# EasyEDA Pro project 内机V10_1.epro, board PCB11_1
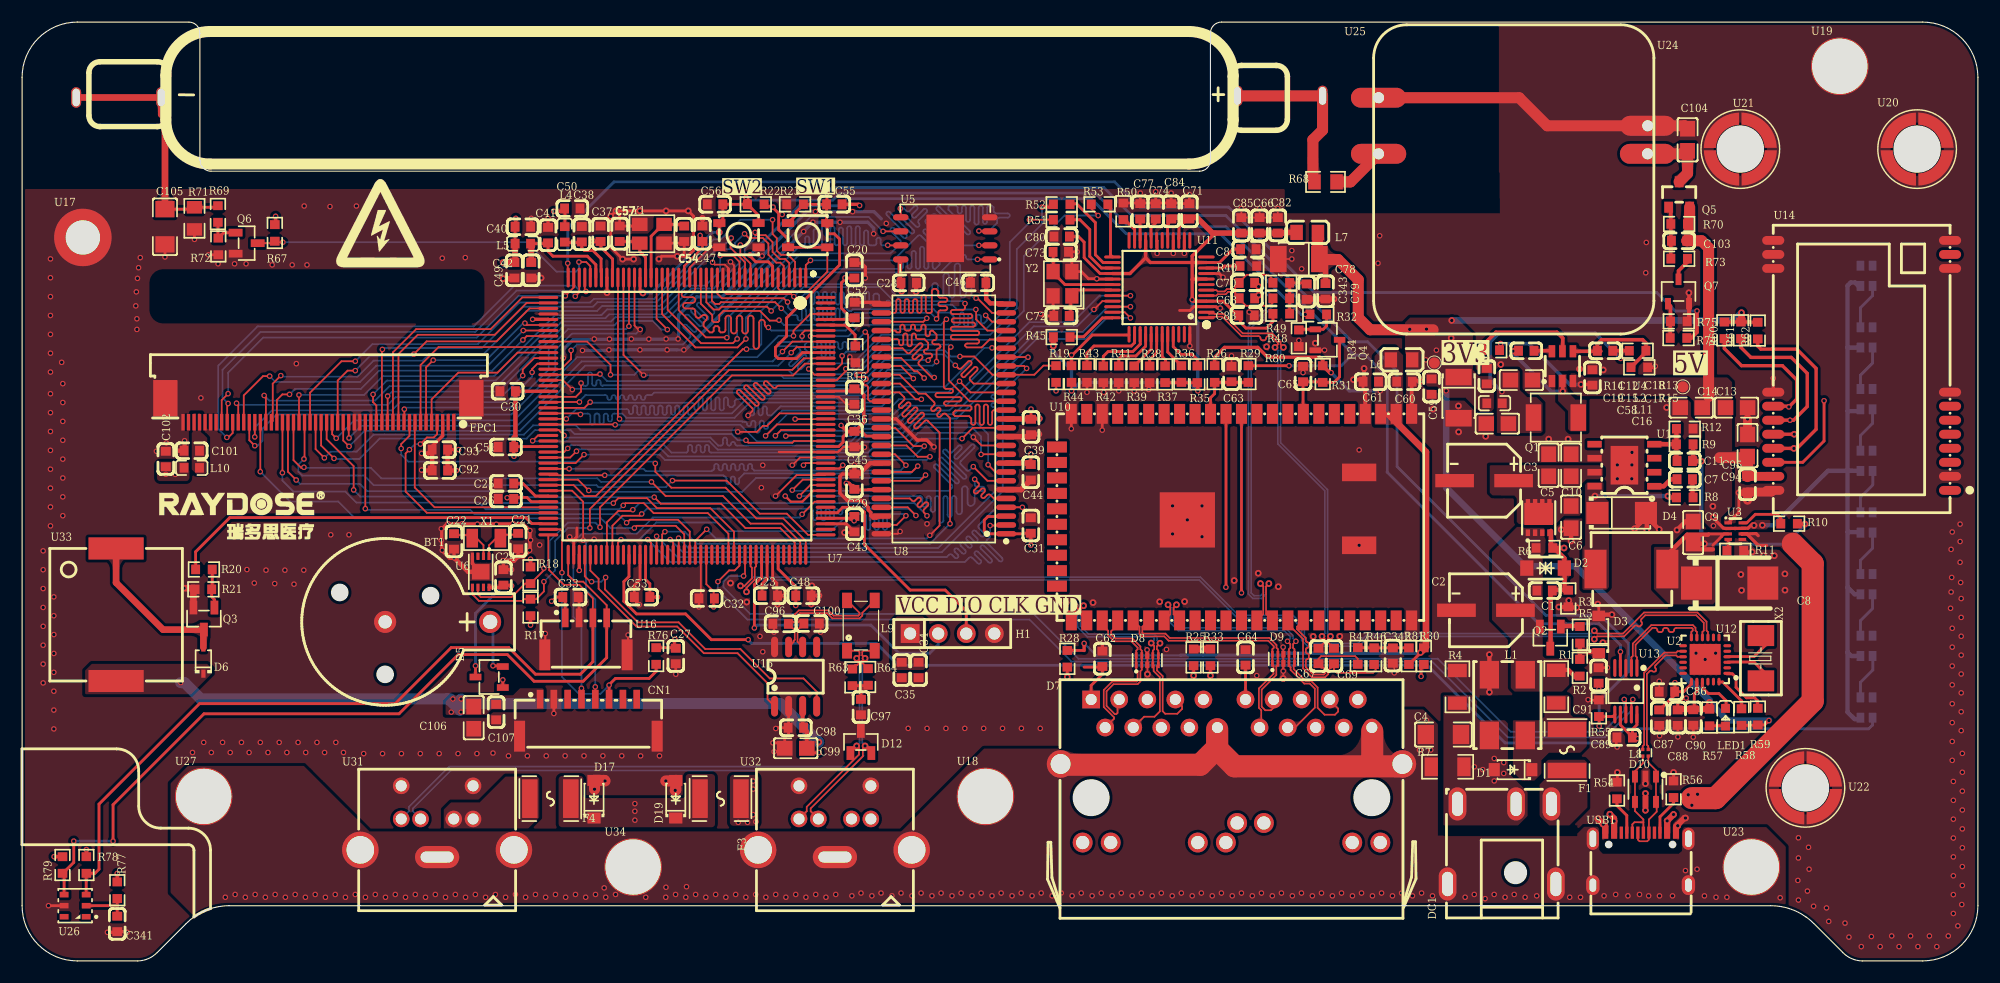
[diagram p6: board, top side]
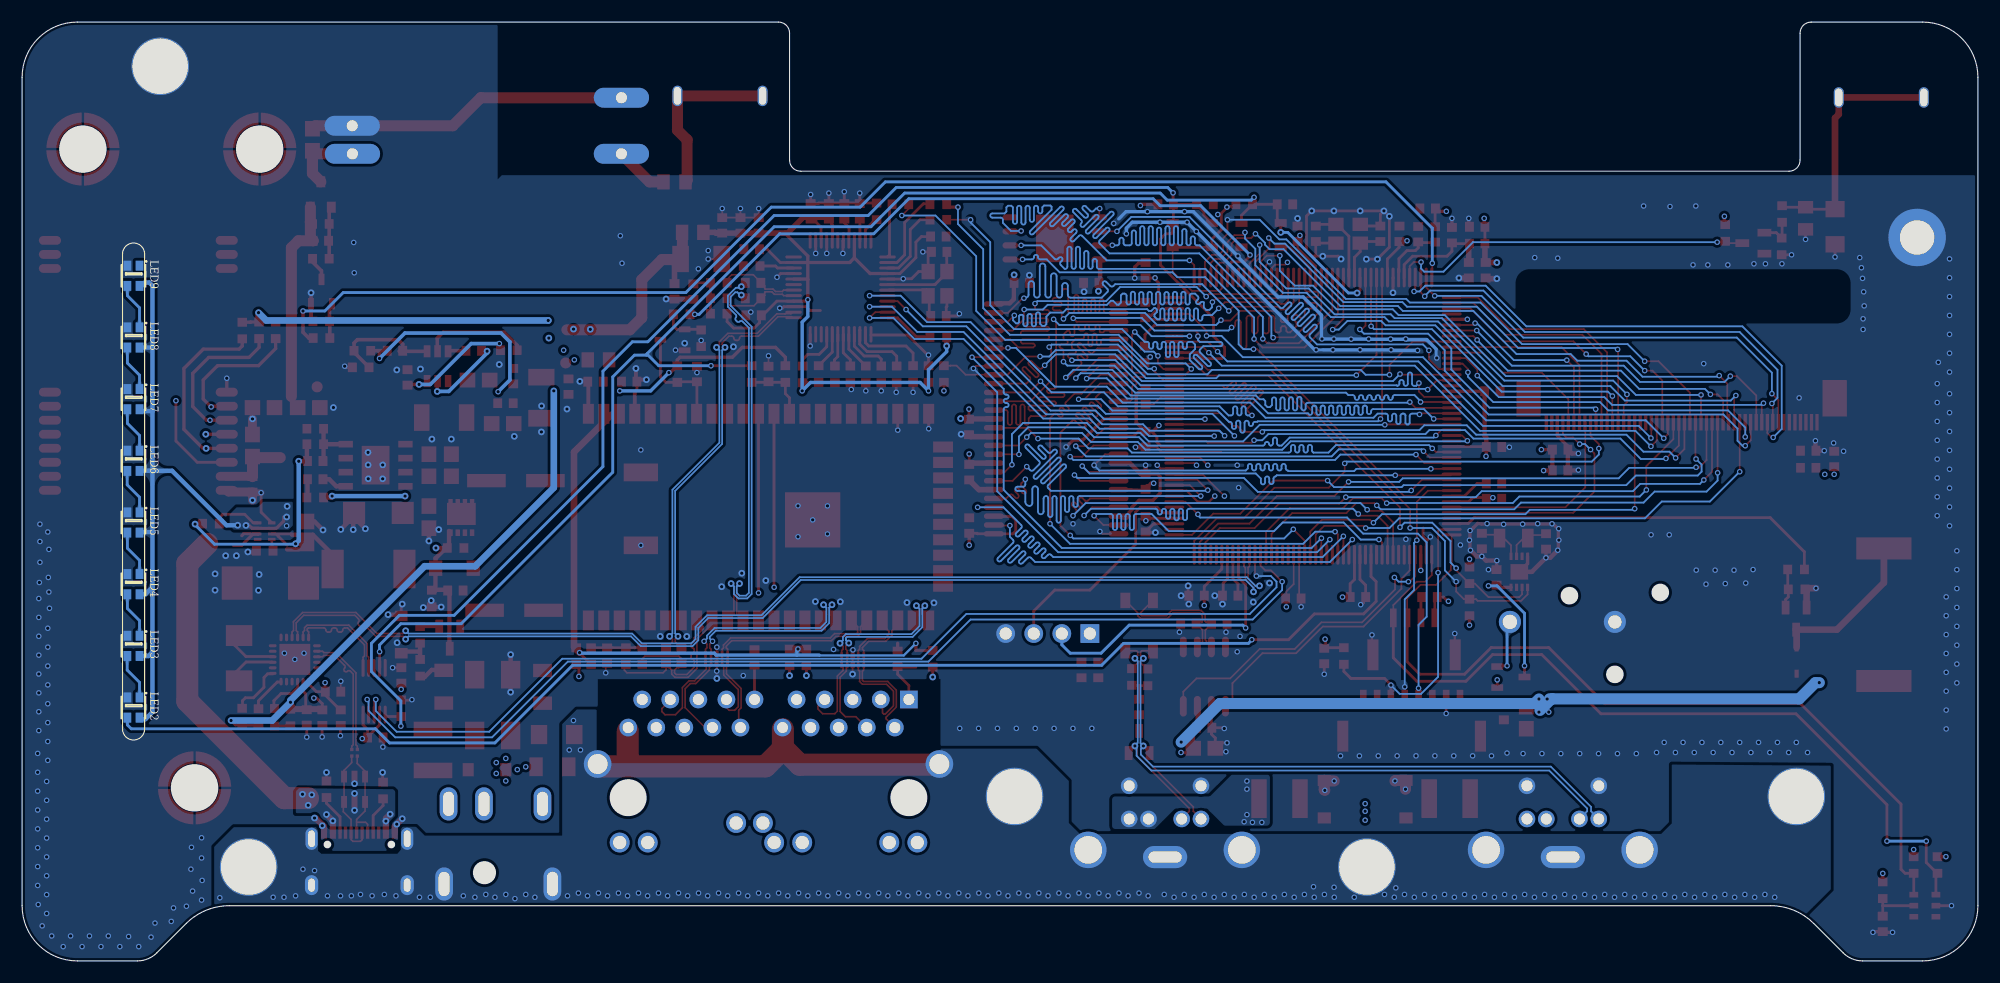
[diagram p7: board, bottom side, seen from below]

Outline 177 x 85 mm; copper layers: Top Layer, Inner1, Inner2, Bottom Layer. Coordinates in mm from the lower left corner of the outline.
Outline path: 0,80 arc(1.46,83.54) 5,85 15.09,85 arc(15.8,84.71) 16.09,84 16.09,72.5 arc(16.39,71.79) 17.09,71.5 106.54,71.5 arc(107.25,71.79) 107.54,72.5 107.54,84 arc(107.84,84.71) 108.54,85 172,85 arc(175.54,83.54) 177,80 177,5 arc(175.54,1.46) 172,0 166.57,0 arc(165.61,0.19) 164.8,0.73 162.15,3.39 arc(161.81,3.71) 161.44,3.99 arc(160.72,4.42) 159.94,4.74 arc(159.11,4.93) 158.26,5 18.74,5 arc(16.64,4.58) 14.85,3.39 12.2,0.73 arc(11.39,0.19) 10.43,0 5,0 arc(1.46,1.46) 0,5 0,80
Stack: Top Layer 0.035mm 外层铜厚1oz / Dielectric1 0.0994mm 3313 RC57% 4.2mil / Inner1 0.0152mm 内层铜厚 / Dielectric2 1.265mm 1.3mm H/HOZ Copper / Inner2 0.0152mm 内层铜厚 / Dielectric3 0.0994mm 3313 RC57% 4.2mil / Bottom Layer 0.035mm 外层铜厚1oz

## Design rules (mm)
net $5N526: DP6
net $5N525: DP6
net WLAN_RXN: DP12
net MDI_TD-: DP11
net WLAN_RXP: DP12
net MDI_TD+: DP11
net MDI_RD-: DP14
net WLAN_TXN: DP13
net MDI_RD+: DP14
net WLAN_TXP: DP13
net RD-: DP8
net RD+: DP8
net TD-: DP7
net TD+: DP7
net TPRX-: DP10
net TPRX+: DP10
net TPTX-: DP9
net TPTX+: DP9
net CANH: DP5
net CANL: DP5
net DN: DP1
net DP: DP1
net USB_D+: DP2
net USB_D-: DP2
net STM32_D+: DP3
net STM32_D-: DP3
net STM32_OTG_D-: DP4
net STM32_OTG_D+: DP4
template: 自定义配置
spacing copperThickness1oz (default): track to track 0.102, other pairs 0.152 to 0.3
spacing copperThickness2oz: track to track 0.203, other pairs 0.152 to 0.3
track width copperThickness1oz (default): min 0.127, default 0.254, max 2.54
track width copperThickness2oz: min 0.203, default 0.254, max 2.54
differential pair differentialPair (default): width min 0.127, default 0.148, max 0.254; gap min 0.102, default 0.102
via viaSize (default): diameter min 0.5, default 0.5, max 10; hole min 0.3, default 0.305, max 6.3
net GND uses copperRegion1
net $2N1394 uses copperRegion1
net VCC_24V uses copperRegion1
net VCC_5V uses copperRegion1
net VCC_3V3 uses copperRegion2
net PHY_3V3 uses copperRegion1
net PGND uses copperRegion1
net $2N7879 uses copperRegion1
net $2N7887 uses copperRegion1
net SYS_5V uses copperRegion1
net LCD_VCC uses copperRegion2
net 24V uses copperRegion1
net LGND uses copperRegion1
net VBUS uses copperRegion1
net $2N4615 uses copperRegion1
net $5N32411 uses copperRegion1
net $5N49929 uses copperRegion1
net $2N31144 uses copperRegion2
pour e416 uses copperRegion1

## Placement (name value [footprint] x y rotation side)
BT1  BS-12-A6AJ019  [BAT-TH_BS-12-A6AJ019]  32.86 30.69 270 top
C1  100nF  [C0603]  137.79 33.53 180 top
C2  100uF  [CAP-SMD_BD6.3-L6.5-W6.5-LS7.2-FD]  132.48 31.75 180 top
C3  100uF  [CAP-SMD_BD6.3-L6.5-W6.5-LS7.2-FD]  132.31 43.48 180 top
C4  1nF/2KV  [C1206]  128.63 20.5 180 top
C5  100nF  [C0805]  138.15 44.88 270 top
C6  100nF  [C0805]  140.18 40.18 90 top
C7  10nF  [C0603]  150.47 43.61 0 top
C8  220uF  [CASE-D_7343]  154.53 34.21 180 top
C9  100nF  [C0805]  151.23 38.78 270 top
C10  100nF  [C0805]  140.18 44.88 270 top
C11  470pF  [C0603]  150.47 45.26 0 top
C12  100nF  [C0603]  136.13 55.24 180 top
C13  22uF  [C0805]  155.16 50.09 180 top
C14  22uF  [C0805]  151.06 50.09 0 top
C15  22uF  [C0805]  135.69 52.59 180 top
C16  22uF  [C0805]  133.51 48.64 0 top
C17  100nF  [C0603]  142.12 52.83 270 top
C18  75pF  [C0603]  143.26 55.24 0 top
C19  100nF  [C0603]  132.56 52.94 270 top
C20  100nF  [C0603]  75.32 62.53 90 top
C21  12pF  [C0603]  44.89 38.02 90 top
C22  12pF  [C0603]  39.08 37.98 90 top
C23  2.2uF  [C0603]  67.67 33.07 0 top
C24  10nF  [C0603]  43.56 34.73 270 top
C25  2.2uF  [C0603]  43.79 43.23 0 top
C26  100nF  [C0603]  43.79 41.83 180 top
C27  100nF  [C0603]  59.16 27.61 270 top
C28  100nF  [C0603]  80.24 61.39 0 top
C29  100nF  [C0603]  75.32 43.39 90 top
C30  100nF  [C0603]  43.94 51.58 180 top
C31  100nF  [C0603]  91.29 39.42 90 top
C32  100nF  [C0603]  61.95 32.81 180 top
C33  100nF  [C0603]  49.63 32.94 0 top
C34  100nF  [C0603]  81.13 26.34 270 top
C35  10uF  [C0603]  79.6 26.34 90 top
C36  10uF  [C0603]  75.32 51.09 90 top
C37  100nF  [C0603]  52.35 65.83 90 top
C38  100nF  [C0603]  50.65 65.79 90 top
C39  10uF  [C0603]  91.31 48.34 90 top
C40  100nF  [C0603]  45.31 66.47 0 top
C41  100nF  [C0603]  47.6 65.71 90 top
C42  10uF  [C0603]  46.08 62.53 90 top
C43  100nF  [C0603]  75.32 39.55 90 top
C44  100nF  [C0603]  91.29 44.24 90 top
C45  100nF  [C0603]  75.32 47.24 90 top
C46  100nF  [C0603]  86.53 61.39 0 top
C47  100nF  [C0603]  61.57 65.83 270 top
C48  100nF  [C0603]  70.71 33.07 180 top
C49  100nF  [C0603]  44.55 62.53 90 top
C50  100nF  [C0603]  49.79 68.12 180 top
C51  100nF  [C0603]  43.79 46.53 0 top
C52  10uF  [C0603]  75.35 58.93 90 top
C53  10uF  [C0603]  56.11 32.94 180 top
C54  20pf  [C0603]  59.92 65.83 90 top
C55  100nF  [C0603]  73.51 68.5 180 top
C56  100nF  [C0603]  62.71 68.5 0 top
C57  20pf  [C0603]  54.08 65.83 270 top
C58  100uF  [CASE-B_3528]  130.01 50.99 270 top
C59  100nF  [C0603]  127.56 51.99 90 top
C60  100nF  [C0603]  125.11 52.44 180 top
C61  100nF  [C0603]  122.06 52.44 0 top
C62  100nF  [C0603]  97.77 27.35 90 top
C63  100nF  [C0603]  109.45 53.13 270 top
C64  100nF  [C0603]  110.72 27.48 90 top
C65  100nF  [C0603]  115.93 53.13 270 top
C66  100nF  [C0603]  111.99 66.6 90 top
C67  6.8nF  [C0603]  117.32 27.61 270 top
C68  6.8nF  [C0603]  110.85 59.99 180 top
C69  6.8nF  [C0603]  118.72 27.61 270 top
C70  6.8nF  [C0603]  110.85 61.39 180 top
C71  100nF  [C0603]  105.64 67.87 90 top
C72  12pF  [C0603_1]  94.07 58.39 0 top
C73  12pF  [C0603_1]  94 64.19 180 top
C74  4.7uF  [C0603]  102.59 67.87 270 top
C77  100nF  [C0603]  101.19 67.87 90 top
C78  100uF  [CASE-B_3528]  115.55 63.55 180 top
C79  100nF  [C0603]  117.96 60.63 90 top
C80  100nF  [C0603]  94.08 65.58 0 top
C81  100nF  [C0603]  110.97 64.44 180 top
C82  100nF  [C0603]  113.64 66.6 270 top
C83  100nF  [C0603]  110.81 58.44 180 top
C84  100nF  [C0603]  103.99 67.87 270 top
C85  100nF  [C0603]  110.34 66.6 270 top
C86  22uF  [C0603_1]  148.86 24.38 0 top
C87  100nF  [C0603]  148.16 22.03 90 top
C88  10uF  [C0603]  149.83 22.03 90 top
C89  100nF  [C0603]  145.03 20.23 0 top
C90  100nF  [C0603]  151.24 22.04 90 top
C91  100nF  [C0603]  142.67 25.84 270 top
C92  10uF  [C0603]  37.81 44.4 180 top
C93  100nF  [C0603]  37.81 46.29 180 top
C94  100nF  [C0603]  156.15 43.15 90 top
C95  22uF  [C0805]  156.15 46.66 270 top
C96  33pF  [C0603]  68.65 30.52 180 top
C97  4.7nF  [C0603]  75.91 22.99 270 top
C98  100nF  [C0603]  70.03 21.11 0 top
C99  10uF  [C0805]  70.01 19.25 0 top
C100  33pF  [C0603]  71.45 30.55 180 top
C101  100nF  [C0603]  15.36 46.19 180 top
C102  100nF  [C0603]  13.01 45.44 90 top
C103  100nF  [C0603]  149.96 65.2 180 top
C104  22uF  [C0805]  150.72 74.34 270 top
C105  270pF  [C1206]  12.93 66.47 90 top
C106  22uF  [C0805]  40.87 22.02 270 top
C107  100nF  [C0603]  42.9 22.53 270 top
C341  10uF  [C0603]  8.61 3.35 270 top
C342  100nF  [C0603]  124.06 27.64 90 top
C343  100nF  [C0603]  116.26 60.59 90 top
CN1  WAFER-GH1.25-8PLB  [CONN-SMD_8P-P1.25_WAFER-GH1.25-8PLB]  51.25 22.02 0 top
D1  SMF26A  [SOD-123_L2.6-W1.8-LS3.7-RD]  134.93 17.31 180 top
D2  PTVSHC1DF12VBH  [SOD-123FL_L2.8-W1.8-LS3.7-BI]  137.87 35.56 180 top
D3  BZT52C30  [SOD-123_L2.8-W1.8-LS3.7-RD]  142.69 29.54 90 top
D4  B340A  [SMA_L4.3-W2.6-LS5.1-RD]  144.76 40.56 0 top
D5  BAT54C,215  [SOT-23-3_L2.9-W1.6-P1.90-LS2.8-BR]  42.27 25.7 0 top
D6  CUS08F30,H3F  [SOD-323F_L2.0-W1.6-LS2.5-RD]  16.41 27.19 90 top
D7  HR915210C  [RJ45-TH_HR915210C]  109.45 17.19 0 top
D8  ESD204DQAR  [USON-10_L2.5-W1.0-P0.50-BL]  101.83 27.23 0 top
D9  ESD204DQAR  [USON-10_L2.5-W1.0-P0.50-BL]  114.15 27.35 0 top
D10  TPD4E001DBVR  [SOT-23-6_L2.9-W1.6-P0.95-LS2.8-BL]  146.91 15.54 180 top
D12  NUP2105LT1G  [SOT-23-3_L2.9-W1.3-P1.90-LS2.4-BR]  75.91 19.82 270 top
D17  SMF26A  [SOD-123_L2.6-W1.8-LS3.7-RD]  51.76 14.64 90 top
D19  SMF26A  [SOD-123_L2.6-W1.8-LS3.7-RD]  59.16 14.64 90 top
DC1  DC-044A-A200  [DC-IN-TH_DC-044A-20A]  133.91 10.59 90 top
F1  SMD1812-050-33  [F1812]  139.82 19.1 90 top
F3  SMD1812-050-33  [F1812]  63.21 14.69 0 top
F4  SMD1812-050-33  [F1812]  47.81 14.69 180 top
FPC1  AFC07-S50ECA-00  [FPC-SMD_AFC07-S50ECA-00]  26.81 49.85 180 top
H1  -  [HDR-TH_4P-P2.54-V-M]  84.18 29.64 0 top
L1  SMCM7060-701T  [FILTER-SMD_4P-L7.0-W6.0-TL_SMCM7060]  134.41 23.16 90 top
L2  3.3uH  [IND-SMD_L4.4-W4.2-A]  138.81 49.19 0 top
L4  GZ1608D601TF  [L0603]  49.11 65.78 270 top
L5  GZ1608D601TF  [L0603]  45.31 64.95 0 top
L6  BLM21PG221SN1D  [L0805]  124.84 54.42 180 top
L7  BLM21PG221SN1D  [L0805]  116.31 65.96 180 top
L8  EXC14CE900U  [FILTER-SMD_4P-L0.9-W0.7-P0.50-BL]  146.91 18.84 0 top
L9  ACT45B-510-2P-TL003  [IND-SMD_4P-L4.5-W3.2-TL]  75.91 30.36 90 top
L10  GZ1608D601TF  [L0603]  15.36 44.64 180 top
L11  MPZ1608S600ATAH0  [L0603]  133.26 50.49 180 top
LED1  NCD0603B1  [LED0603-RD]  154.16 22.06 270 top
LED2  WS2812B-2020  [LED-SMD_4P-L2.0-W2.0-TL_WS2812B-2020]  166.92 22.94 270 bottom
LED3  WS2812B-2020  [LED-SMD_4P-L2.0-W2.0-TL_WS2812B-2020]  166.92 28.52 270 bottom
LED4  WS2812B-2020  [LED-SMD_4P-L2.0-W2.0-TL_WS2812B-2020]  166.92 34.11 270 bottom
LED5  WS2812B-2020  [LED-SMD_4P-L2.0-W2.0-TL_WS2812B-2020]  166.92 39.69 270 bottom
LED6  WS2812B-2020  [LED-SMD_4P-L2.0-W2.0-TL_WS2812B-2020]  166.92 45.28 270 bottom
LED7  WS2812B-2020  [LED-SMD_4P-L2.0-W2.0-TL_WS2812B-2020]  166.92 50.86 270 bottom
LED8  WS2812B-2020  [LED-SMD_4P-L2.0-W2.0-TL_WS2812B-2020]  166.92 56.45 270 bottom
LED9  WS2812B-2020  [LED-SMD_4P-L2.0-W2.0-TL_WS2812B-2020]  166.92 62.03 270 bottom
Q1  CJAE10P06  [DFN-8_L3.0-W3.0-P0.65-BL_G48N03D3]  137.39 40.31 0 top
Q2  MMBT3906  [SOT-23-3_L2.9-W1.3-P1.90-LS2.4-BR]  138.3 29.27 90 top
Q3  AO3400A  [SOT-23-3_L2.9-W1.3-P1.90-LS2.4-BR]  16.46 30.99 90 top
Q4  S8050  [SOT-23-3_L3.0-W1.7-P0.95-LS2.9-BR]  118.13 56.23 180 top
Q5  AO3401A  [SOT-23_L2.9-W1.3-P1.90-LS2.4-BR]  149.96 69.39 270 top
Q6  MMBT3904  [SOT-23-3_L2.9-W1.3-P1.90-LS2.4-BR]  20.32 64.98 180 top
Q7  S8050 J3Y(RANGE:200-350)  [SOT-23-3_L3.0-W1.7-P0.95-LS2.9-BR]  149.91 60.61 270 top
R1  0Ω  [R1206]  138.84 24.83 90 top
R2  47kΩ  [R0603]  140.98 26.54 270 top
R3  20kΩ  [R0603]  139.93 32.81 90 top
R4  0Ω  [R1206]  129.9 24.81 90 top
R5  4.7kΩ  [R0603]  140.98 29.52 90 top
R6  10kΩ  [R0603]  137.77 37.39 180 top
R7  1MΩ  [R1206]  129.01 17.57 180 top
R8  0Ω  [R0603]  150.47 41.96 180 top
R9  10kΩ  [R0603]  150.47 46.78 0 top
R10  10kΩ  [R0603]  159.91 39.59 180 top
R11  10kΩ  [R0603]  155.04 37.13 0 top
R12  3.24kΩ  [R0603]  150.47 48.18 180 top
R13  33.2kΩ  [R0603]  146.21 55.24 180 top
R14  10kΩ  [R0603]  132.96 55.29 0 top
R15  10kΩ  [R0603]  146.36 53.74 180 top
R16  10kΩ  [R0603]  75.41 54.91 270 top
R17  4.7kΩ  [R0603]  46.01 32 270 top
R18  4.7kΩ  [R0603]  46.01 34.91 90 top
R19  10kΩ  [R0603]  93.57 53.13 90 top
R20  0Ω  [R0603]  16.46 35.44 0 top
R21  10kΩ  [R0603]  16.41 33.64 0 top
R22  10kΩ  [R0603]  66.4 68.5 0 top
R23  10kΩ  [R0603]  69.95 68.5 0 top
R25  510Ω  [R0603]  106.02 27.48 90 top
R26  10kΩ  [R0603]  107.93 53.13 270 top
R28  510Ω  [R0603]  94.59 27.35 90 top
R29  0Ω  [R0603]  110.97 53.13 90 top
R30  510Ω  [R0603]  126.86 27.59 90 top
R31  10kΩ  [R0603]  117.7 53.13 270 top
R32  510Ω  [R0603]  117.31 58.54 0 top
R33  510Ω  [R0603]  107.54 27.48 90 top
R34  10kΩ  [R0603]  115.55 56.37 270 top
R35  10kΩ  [R0603]  106.36 53.11 90 top
R36  10kΩ  [R0603]  104.91 53.13 90 top
R37  10kΩ  [R0603]  103.44 53.11 90 top
R38  10kΩ  [R0603]  102.04 53.11 90 top
R39  10kΩ  [R0603]  100.64 53.11 90 top
R40  12.4K  [R0603]  110.97 62.91 0 top
R41  10kΩ  [R0603]  99.25 53.11 90 top
R42  10kΩ  [R0603]  97.85 53.11 90 top
R43  10kΩ  [R0603]  96.37 53.13 90 top
R44  10kΩ  [R0603]  94.97 53.13 90 top
R45  10kΩ  [R0603]  94.08 56.48 0 top
R46  49.9Ω  [R0603]  122.36 27.59 270 top
R47  49.9Ω  [R0603]  120.88 27.61 270 top
R48  49.9Ω  [R0603]  113.96 59.99 180 top
R49  49.9Ω  [R0603]  113.96 61.39 180 top
R50  10kΩ  [R0603]  99.67 67.87 90 top
R51  1kΩ  [R0603]  94.08 67.1 0 top
R52  1kΩ  [R0603]  94.08 68.5 0 top
R53  1kΩ  [R0603]  97.51 68.5 0 top
R54  5.1K  [R0603]  144.33 15.43 90 top
R55  4.7kΩ  [R0603]  142.7 22.88 270 top
R56  5.1K  [R0603]  149.45 15.54 270 top
R57  470Ω  [R0603]  152.71 22.04 90 top
R58  10kΩ  [R0603]  155.61 22.08 90 top
R59  10kΩ  [R0603]  157.09 22.12 90 top
R60  10kΩ  [R0603]  154.06 57.09 270 top
R61  10kΩ  [R0603]  155.56 57.09 270 top
R62  10kΩ  [R0603]  157.07 57.07 270 top
R63  60Ω  [R0603]  75.14 25.67 90 top
R64  60Ω  [R0603]  76.56 25.71 270 top
R67  10kΩ  [R0603]  22.87 65.91 270 top
R68  10MΩ  [R0805]  117.96 70.53 180 top
R69  10kΩ  [R0603]  17.72 67.62 90 top
R70  100kΩ  [R0603]  149.96 66.72 180 top
R71  100kΩ  [R0805]  15.6 67.23 90 top
R72  100kΩ  [R0603]  17.76 64.69 270 top
R73  1kΩ  [R0603]  149.96 63.58 180 top
R74  1kΩ  [R0603]  149.91 56.39 0 top
R75  10kΩ  [R0603]  149.93 57.9 180 top
R76  10kΩ  [R0603]  57.38 27.61 90 top
R77  330Ω  [R0603]  8.61 6.4 270 top
R78  4.7kΩ  [R0603]  5.82 8.68 90 top
R79  4.7kΩ  [R0603]  3.66 8.68 90 top
R80  0Ω  [R0603]  113.96 58.59 0 top
R81  0Ω  [R0603]  125.51 27.59 90 top
SW1  -  [KEY-SMD_4P-L3.3-W3.3-P2.20-LS3.9]  71.1 65.71 0 top
SW2  -  [KEY-SMD_4P-L3.3-W3.3-P2.20-LS3.9]  64.87 65.71 0 top
TP1  -  [Test-Point-1mm]  127.8 54.14 0 top
TP2  -  [Test-Point-1mm]  150.3 51.97 0 top
U1  TPS5430DDAR  [ESOP-8_L4.9-W3.9-P1.27-LS6.0-TL-EP]  145.01 44.88 180 top
U2  22uH  [IND-SMD_L6.8-W6.8_FCH0650]  145.64 35.48 0 top
U3  LM66200DRLR  [SOT-583-8_L2.1-W1.2-P0.50-LS1.6-BL]  155.04 38.91 270 top
U4  TPS562201DDCR  [SOT-23-6_L2.9-W1.6-P0.95-LS2.8-BR]  139.4 53.85 270 top
U5  W25Q64JVZEIQ  [WSON-8_L8.0-W6.10-P1.27-BL-EP]  83.55 65.42 90 top
U6  400kHz  [VSON-8_L2.0-W3.0-P0.50-BL-EP]  41.5 35.23 180 top
U7  STM32H743IIT6  [LQFP-176_L24.0-W24.0-P0.50-LS26.0-BL]  60.17 49.32 180 top
U8  W9825G6KH-6  [TSOP-54_L22.2-W10.2-P0.80-LS11.8-BL]  83.41 49.07 90 top
U10  2.412GHz；2.483GHz  [WIRELM-SMD_HLK-7688A]  109.7 40.18 0 top
U11  W5500  [LQFP-48_L7.0-W7.0-P0.50-LS9.0-BL]  102.93 60.98 90 top
U12  CH334F  [QFN-24_L4.0-W4.0-P0.50-BL-EP2.8]  152.32 27.29 90 top
U13  CH340X  [MSOP-10_L3.0-W3.0-P0.50-LS5.0-BL]  145.14 24.42 180 top
U14  E32-433T20S  [WIRELM-SMD_E32-433T20S]  166.48 53.92 180 top
U15  TJA1051T  [SOP-8_L4.9-W3.9-P1.27-LS6.0-BL]  70 25.74 0 top
U16  WAFER-GH1.25-4PLB  [CONN-SMD_4P-P1.25_XUNPU_WAFER-GH1.25-4PLB]  51.03 29.39 0 top
U17  -  [3M螺丝孔]  5.5 65.5 0 top
U18  -  [3M螺丝孔#2]  87.18 14.89 0 top
U19  -  [3M螺丝孔#2]  164.5 81 0 top
U20  SMTSOM340STR  [SMD_BD6.2-D4.1]  171.5 73.5 0 top
U21  SMTSOM340STR  [SMD_BD6.2-D4.1]  155.5 73.5 0 top
U22  SMTSOM340STR  [SMD_BD6.2-D4.1]  161.39 15.67 0 top
U23  -  [3M螺丝孔#2]  156.5 8.5 0 top
U24  -  [反激电源模块_5v升压400v]  147.68 84.76 180 top
U25  -  [盖革管4313]  62.97 80.31 180 top
U26  AHT20  [SENSOR-SMD_L3.0-W3.0-P1.00-BR]  4.8 5 0 top
U27  -  [3M螺丝孔#2]  16.43 14.89 0 top
U31  DIN-603  [PS2-TH_DIN_603]  37.56 12.59 0 top
U32  DIN-603  [PS2-TH_DIN_603]  73.56 12.59 0 top
U33  4kHz  [BUZ-SMD_L12.0-W12.0]  8.51 31.34 90 top
U34  -  [3M螺丝孔#2]  55.3 8.5 0 top
USB1  TYPE-C 16PIN  [USB-C-SMD_TYPE-C-6PIN-2MD-073]  146.48 9.23 0 top
X1  32.768kHz  [OSC-SMD_L3.2-W1.5]  42.01 38.28 0 top
X2  12MHz  [CRYSTAL-SMD_L5.0-W3.2-1]  157.36 27.41 270 top
Y1  25MHz  [CRYSTAL-SMD_4P-L3.2-W2.5-BL]  57 65.83 0 top
Y2  25MHz  [CRYSTAL-SMD_4P-L3.2-W2.5-BL]  94.15 61.31 90 top

## Footprints (pads in the part's own frame, mm; a bottom-side part is the same pattern mirrored in y, then rotated)
3M螺丝孔
  round 5.2 hole 3.1: 1(0,0)
3M螺丝孔#2
  round 5.2 hole 5x3.1: 1(0,0)
BAT-TH_BS-12-A6AJ019
  round 2 hole 1.3: 1(0,9.5)
  round 2 hole 1.2: 2(0,0)
BUZ-SMD_L12.0-W12.0
  rect 2x5 smd: 1(-6,0) 2(6,0)
C0603
  rect 0.8x0.9 smd: 1(-0.7,0) 2(0.7,0)
C0603_1
  rect 0.8x0.9 smd: 1(-0.7,0) 2(0.7,0)
C0805
  rect 1.41x1.35 smd: 1(-1,0) 2(1,0)
C1206
  rect 1.485x1.728 smd: 1(-1.593,0) 2(1.593,0)
CAP-SMD_BD6.3-L6.5-W6.5-LS7.2-FD
  rect 3.5x1.2 smd: 1(-2.67,0) 2(2.67,0)
CASE-B_3528
  rect 1.506x2.376 smd: 1(-1.861,0) 2(1.861,0)
CASE-D_7343
  rect 2.799x3.01 smd: 1(3,0) 2(-3,0)
CONN-SMD_4P-P1.25_XUNPU_WAFER-GH1.25-4PLB
  rect 0.6x1.7 smd: 1(-1.875,1.675) 2(-0.625,1.675) 3(0.625,1.675) 4(1.875,1.675)
  rect 1x2.8 smd: 5(-3.725,-1.675) 6(3.725,-1.675)
CONN-SMD_8P-P1.25_WAFER-GH1.25-8PLB
  rect 0.6x1.7 smd: 1(-4.375,1.675) 2(-3.126,1.675) 3(-1.875,1.675) 4(-0.625,1.675) 5(0.625,1.675) 6(1.875,1.675) 7(3.125,1.675) 8(4.375,1.675)
  rect 1x2.8 smd: 10(6.225,-1.675) 11(-6.225,-1.675)
CRYSTAL-SMD_4P-L3.2-W2.5-BL
  rect 1.4x1.2 smd: 1(-1.1,-0.85) 2(1.1,-0.85) 3(1.1,0.85) 4(-1.1,0.85)
CRYSTAL-SMD_L5.0-W3.2-1
  rect 1.9x2.4 smd: 1(-2.05,0) 2(2.05,0)
DC-IN-TH_DC-044A-20A
  oval 3x1.6 hole 2.2x1: 1(3.625,-4.5) 2(3.625,4.001) 3(3.625,-1.3) 4(-3.625,-4.9) 5(-3.625,4.9)
DFN-8_L3.0-W3.0-P0.65-BL_G48N03D3
  rect 0.4x0.6 smd: 1(-1.115,-1.54) 2(-0.465,-1.54) 3(0.185,-1.54) 4(0.836,-1.54) 5(0.836,1.21) 6(0.185,1.21) 7(-0.465,1.21) 8(-1.115,1.21)
  rect 2.6x2 smd: 9(-0.14,0.16)
ESOP-8_L4.9-W3.9-P1.27-LS6.0-TL-EP
  rect 1.3x0.6 smd: 1(-2.7,1.905) 2(-2.7,0.635) 3(-2.7,-0.635) 4(-2.7,-1.905) 5(2.7,-1.905) 6(2.7,-0.635) 7(2.7,0.635) 8(2.7,1.905)
  rect 2.5x3.5 smd: 9(0,0)
F1812
  rect 1.407x3.499 smd: 1(-1.853,0) 2(1.853,0)
FILTER-SMD_4P-L0.9-W0.7-P0.50-BL
  rect 0.3x0.3 smd: 1(-0.25,-0.3) 2(0.25,-0.3) 3(0.25,0.3) 4(-0.25,0.3)
FILTER-SMD_4P-L7.0-W6.0-TL_SMCM7060
  rect 2.5x1.75 smd: 1(-2.75,1.625) 2(-2.75,-1.625) 3(2.75,-1.625) 4(2.75,1.625)
FPC-SMD_AFC07-S50ECA-00
  rect 0.3x1.5 smd: 1(-12.248,1.086) 2(-11.75,1.085) 3(-11.25,1.085) 4(-10.75,1.085) 5(-10.25,1.085) 6(-9.75,1.085) 7(-9.25,1.085) 8(-8.75,1.085) 9(-8.25,1.085) 10(-7.75,1.085) 11(-7.25,1.085) 12(-6.75,1.085) 13(-6.25,1.085) 14(-5.75,1.085) 15(-5.25,1.085) 16(-4.75,1.085) 17(-4.25,1.085) 18(-3.75,1.085) 19(-3.25,1.085) 20(-2.75,1.085) 21(-2.25,1.085) 22(-1.75,1.085) 23(-1.25,1.085) 24(-0.75,1.085) 25(-0.25,1.085) 26(0.25,1.085) 27(0.75,1.085) 28(1.25,1.085) 29(1.75,1.085) 30(2.25,1.085) 31(2.75,1.085) 32(3.25,1.085) 33(3.75,1.085) 34(4.25,1.085) 35(4.75,1.085) 36(5.25,1.085) 37(5.75,1.085) 38(6.25,1.085) 39(6.75,1.085) 40(7.25,1.085) 41(7.752,1.086) 42(8.249,1.084) 43(8.749,1.085) 44(9.25,1.085) 45(9.751,1.085) 46(10.251,1.085) 47(10.751,1.085) 48(11.249,1.085) 49(11.75,1.085) 50(12.248,1.085)
  rect 2.2x3.3 smd: 51(13.85,-1.086) 52(-13.85,-1.086)
HDR-TH_4P-P2.54-V-M
  rect 1.7x1.7 hole 1.1: 1(-3.81,0)
  round 1.7 hole 1.1: 2(-1.27,0) 3(1.27,0) 4(3.81,0)
IND-SMD_4P-L4.5-W3.2-TL
  rect 1.4x0.9 smd: 1(-2.28,1.25) 2(-2.28,-1.25) 3(2.28,-1.25) 4(2.28,1.25)
IND-SMD_L4.4-W4.2-A
  rect 1.4x2.4 smd: 1(2.028,0) 2(-2.028,0)
IND-SMD_L6.8-W6.8_FCH0650
  rect 2x3.5 smd: 1(-3.25,0) 2(3.25,0)
KEY-SMD_4P-L3.3-W3.3-P2.20-LS3.9
  rect 1.1x0.701 smd: 1(-1.776,1.1) 2(1.776,1.1) 3(-1.776,-1.1) 4(1.776,-1.1)
L0603
  rect 0.8x0.864 smd: 1(-0.7,0) 2(0.7,0)
L0805
  rect 1.133x1.377 smd: 1(-0.966,0) 2(0.966,0)
LED0603-RD
  rect 0.8x0.8 smd: 1(-0.799,0) 2(0.799,0)
LED-SMD_4P-L2.0-W2.0-TL_WS2812B-2020
  rect 0.9x0.7 smd: 1(-0.915,0.55) 2(-0.915,-0.55) 3(0.915,-0.55) 4(0.915,0.55)
LQFP-48_L7.0-W7.0-P0.50-LS9.0-BL
  oval 0.27x1.5 smd: 1(-2.75,-4.25) 2(-2.25,-4.25) 3(-1.75,-4.25) 4(-1.25,-4.25) 5(-0.75,-4.25) 6(-0.25,-4.25) 7(0.25,-4.25) 8(0.75,-4.25) 9(1.25,-4.25) 10(1.75,-4.25) 11(2.25,-4.25) 12(2.75,-4.25) 25(2.75,4.25) 26(2.25,4.25) 27(1.75,4.25) 28(1.25,4.25) 29(0.75,4.25) 30(0.25,4.25) 31(-0.25,4.25) 32(-0.75,4.25) 33(-1.25,4.25) 34(-1.75,4.25) 35(-2.25,4.25) 36(-2.75,4.25)
  oval 1.5x0.27 smd: 13(4.25,-2.75) 14(4.25,-2.25) 15(4.25,-1.75) 16(4.25,-1.25) 17(4.25,-0.75) 18(4.25,-0.25) 19(4.25,0.25) 20(4.25,0.75) 21(4.25,1.25) 22(4.25,1.75) 23(4.25,2.25) 24(4.25,2.75) 37(-4.25,2.75) 38(-4.25,2.25) 39(-4.25,1.75) 40(-4.25,1.25) 41(-4.25,0.75) 42(-4.25,0.25) 43(-4.25,-0.25) 44(-4.25,-0.75) 45(-4.25,-1.25) 46(-4.25,-1.75) 47(-4.25,-2.25) 48(-4.25,-2.75)
LQFP-176_L24.0-W24.0-P0.50-LS26.0-BL
  oval 0.28x1.8 smd: 1(-10.75,-12.55) 2(-10.25,-12.55) 3(-9.75,-12.55) 4(-9.25,-12.55) 5(-8.75,-12.55) 6(-8.25,-12.55) 7(-7.75,-12.55) 8(-7.25,-12.55) 9(-6.75,-12.55) 10(-6.25,-12.55) 11(-5.75,-12.55) 12(-5.25,-12.55) 13(-4.75,-12.55) 14(-4.25,-12.55) 15(-3.75,-12.55) 16(-3.25,-12.55) 17(-2.75,-12.55) 18(-2.25,-12.55) 19(-1.75,-12.55) 20(-1.25,-12.55) 21(-0.75,-12.55) 22(-0.25,-12.55) 23(0.25,-12.55) 24(0.75,-12.55) 25(1.25,-12.55) 26(1.75,-12.55) 27(2.25,-12.55) 28(2.75,-12.55) 29(3.25,-12.55) 30(3.75,-12.55) 31(4.25,-12.55) 32(4.75,-12.55) 33(5.25,-12.55) 34(5.75,-12.55) 35(6.25,-12.55) 36(6.75,-12.55) 37(7.25,-12.55) 38(7.75,-12.55) 39(8.25,-12.55) 40(8.75,-12.55) 41(9.25,-12.55) 42(9.75,-12.55) 43(10.25,-12.55) 44(10.75,-12.55) 89(10.75,12.55) 90(10.25,12.55) 91(9.75,12.55) 92(9.25,12.55) 93(8.75,12.55) 94(8.25,12.55) 95(7.75,12.55) 96(7.25,12.55) 97(6.75,12.55) 98(6.25,12.55) 99(5.75,12.55) 100(5.25,12.55) 101(4.75,12.55) 102(4.25,12.55) 103(3.75,12.55) 104(3.25,12.55) 105(2.75,12.55) 106(2.25,12.55) 107(1.75,12.55) 108(1.25,12.55) 109(0.75,12.55) 110(0.25,12.55) 111(-0.25,12.55) 112(-0.75,12.55) 113(-1.25,12.55) 114(-1.75,12.55) 115(-2.25,12.55) 116(-2.75,12.55) 117(-3.25,12.55) 118(-3.75,12.55) 119(-4.25,12.55) 120(-4.75,12.55) 121(-5.25,12.55) 122(-5.75,12.55) 123(-6.25,12.55) 124(-6.75,12.55) 125(-7.25,12.55) 126(-7.75,12.55) 127(-8.25,12.55) 128(-8.75,12.55) 129(-9.25,12.55) 130(-9.75,12.55) 131(-10.25,12.55) 132(-10.75,12.55)
  oval 1.8x0.28 smd: 45(12.55,-10.75) 46(12.55,-10.25) 47(12.55,-9.75) 48(12.55,-9.25) 49(12.55,-8.75) 50(12.55,-8.25) 51(12.55,-7.75) 52(12.55,-7.25) 53(12.55,-6.75) 54(12.55,-6.25) 55(12.55,-5.75) 56(12.55,-5.25) 57(12.55,-4.75) 58(12.55,-4.25) 59(12.55,-3.75) 60(12.55,-3.25) 61(12.55,-2.75) 62(12.55,-2.25) 63(12.55,-1.75) 64(12.55,-1.25) 65(12.55,-0.75) 66(12.55,-0.25) 67(12.55,0.25) 68(12.55,0.75) 69(12.55,1.25) 70(12.55,1.75) 71(12.55,2.25) 72(12.55,2.75) 73(12.55,3.25) 74(12.55,3.75) 75(12.55,4.25) 76(12.55,4.75) 77(12.55,5.25) 78(12.55,5.75) 79(12.55,6.25) 80(12.55,6.75) 81(12.55,7.25) 82(12.55,7.75) 83(12.55,8.25) 84(12.55,8.75) 85(12.55,9.25) 86(12.55,9.75) 87(12.55,10.25) 88(12.55,10.75) 133(-12.55,10.75) 134(-12.55,10.25) 135(-12.55,9.75) 136(-12.55,9.25) 137(-12.55,8.75) 138(-12.55,8.25) 139(-12.55,7.75) 140(-12.55,7.25) 141(-12.55,6.75) 142(-12.55,6.25) 143(-12.55,5.75) 144(-12.55,5.25) 145(-12.55,4.75) 146(-12.55,4.25) 147(-12.55,3.75) 148(-12.55,3.25) 149(-12.55,2.75) 150(-12.55,2.25) 151(-12.55,1.75) 152(-12.55,1.25) 153(-12.55,0.75) 154(-12.55,0.25) 155(-12.55,-0.25) 156(-12.55,-0.75) 157(-12.55,-1.25) 158(-12.55,-1.75) 159(-12.55,-2.25) 160(-12.55,-2.75) 161(-12.55,-3.25) 162(-12.55,-3.75) 163(-12.55,-4.25) 164(-12.55,-4.75) 165(-12.55,-5.25) 166(-12.55,-5.75) 167(-12.55,-6.25) 168(-12.55,-6.75) 169(-12.55,-7.25) 170(-12.55,-7.75) 171(-12.55,-8.25) 172(-12.55,-8.75) 173(-12.55,-9.25) 174(-12.55,-9.75) 175(-12.55,-10.25) 176(-12.55,-10.75)
MSOP-10_L3.0-W3.0-P0.50-LS5.0-BL
  oval 0.28x1.62 smd: 1(-1,-2.11) 2(-0.5,-2.11) 3(0,-2.11) 4(0.5,-2.11) 5(1,-2.11) 6(1,2.11) 7(0.5,2.11) 8(0,2.11) 9(-0.5,2.11) 10(-1,2.11)
OSC-SMD_L3.2-W1.5
  rect 1.05x1.7 smd: 1(-1.275,0) 2(1.275,0)
PS2-TH_DIN_603
  round 1.5 hole 1: 1(1.505,0.259) 2(-1.495,0.259) 3(3.255,0.259) 4(-3.245,0.259) 5(3.255,3.259) 6(-3.245,3.259)
  round 3.3 hole 2.5: 7(6.955,-2.541) 9(-6.945,-2.541)
  oval 4x2 hole 3x1: 8(0.005,-3.191)
QFN-24_L4.0-W4.0-P0.50-BL-EP2.8
  oval 0.28x0.7 smd: 1(-1.25,-2) 2(-0.75,-2) 3(-0.25,-2) 4(0.25,-2) 5(0.75,-2) 6(1.25,-2) 13(1.25,2) 14(0.75,2) 15(0.25,2) 16(-0.25,2) 17(-0.75,2) 18(-1.25,2)
  oval 0.7x0.28 smd: 7(2,-1.25) 8(2,-0.75) 9(2,-0.25) 10(2,0.25) 11(2,0.75) 12(2,1.25) 19(-2,1.25) 20(-2,0.75) 21(-2,0.25) 22(-2,-0.25) 23(-2,-0.75) 24(-2,-1.25)
  rect 2.8x2.8 smd: 25(0.013,0)
R0603
  rect 0.806x0.864 smd: 1(-0.753,0) 2(0.753,0)
R0805
  rect 1.133x1.377 smd: 1(-1,0) 2(1,0)
R1206
  rect 1.208x1.701 smd: 1(-1.479,0) 2(1.479,0)
RJ45-TH_HR915210C
  rect 1.6x1.6 hole 1: 1(-12.7,6.475)
  round 1.6 hole 1: 2(-11.43,3.935) 2(1)(1.27,6.475) 2(2)(2.54,3.935) 2(3)(3.81,6.475) 2(4)(5.08,3.935) 2(5)(6.35,6.475) 2(6)(7.62,3.935) 2(7)(8.89,6.475) 2(8)(10.16,3.935) 2(9)(11.43,6.475) 2(10)(12.7,3.935) 3(-10.16,6.475) 4(-8.89,3.935) 5(-7.62,6.475) 6(-6.35,3.935) 7(-5.08,6.475) 8(-3.81,3.935) 9(-2.54,6.475) 10(-1.27,3.935)
  round 1.8 hole 1.2: 2(11)(0.51,-4.705) 2(12)(2.93,-4.705) 2(13)(10.93,-6.475) 2(14)(13.47,-6.475) 11(-13.47,-6.475) 12(-10.93,-6.475) 13(-3.05,-6.475) 14(-0.51,-6.475)
  round 2.5 hole 1.8: 29(15.465,0.635) 30(-15.465,0.635)
SENSOR-SMD_L3.0-W3.0-P1.00-BR
  rect 0.8x0.5 smd: 1(1,-1) 2(1,0) 3(1,1) 4(-1,1) 5(-1,0) 6(-1,-1)
SMA_L4.3-W2.6-LS5.1-RD
  rect 2x2 smd: 1(-2.2,0) 2(2.2,0)
SMD_BD6.2-D4.1
  custom 3.2x3.2 smd: 1(2.119,1.71) 2(-1.71,2.119) 3(-2.119,-1.71) 4(1.71,-2.119)
SOD-123_L2.6-W1.8-LS3.7-RD
  rect 1x1.2 smd: 1(-1.7,0) 2(1.7,0)
SOD-123_L2.8-W1.8-LS3.7-RD
  rect 0.95x1.15 smd: 1(-1.692,0) 2(1.692,0)
SOD-123FL_L2.8-W1.8-LS3.7-BI
  rect 1.2x1.4 smd: 1(-1.7,0) 2(1.7,0)
SOD-323F_L2.0-W1.6-LS2.5-RD
  rect 0.73x0.385 smd: 1(-1.185,0) 2(1.185,0)
SOP-8_L4.9-W3.9-P1.27-LS6.0-BL
  oval 0.63x1.865 smd: 1(-1.905,-2.683) 2(-0.635,-2.683) 3(0.635,-2.683) 4(1.905,-2.683) 5(1.905,2.683) 6(0.635,2.683) 7(-0.635,2.683) 8(-1.905,2.683)
SOT-23-3_L2.9-W1.3-P1.90-LS2.4-BR
  rect 1.25x0.7 smd: 1(1,-0.95) 2(1,0.95) 3(-1,0)
SOT-23-3_L2.9-W1.6-P1.90-LS2.8-BR
  rect 1.07x0.6 smd: 1(1.235,-0.95) 2(1.235,0.95) 3(-1.235,0)
SOT-23-3_L3.0-W1.7-P0.95-LS2.9-BR
  rect 1.038x0.532 smd: 1(1.101,-0.95) 2(1.101,0.95) 3(-1.101,0)
SOT-23-6_L2.9-W1.6-P0.95-LS2.8-BL
  rect 0.532x1.072 smd: 1(-0.95,-1.149) 2(0,-1.149) 3(0.95,-1.149) 4(0.95,1.149) 5(0,1.149) 6(-0.95,1.149)
SOT-23-6_L2.9-W1.6-P0.95-LS2.8-BR
  rect 1.1x0.6 smd: 1(1.35,-0.95) 2(1.35,0) 3(1.35,0.95) 4(-1.35,0.95) 5(-1.35,0) 6(-1.35,-0.95)
SOT-23_L2.9-W1.3-P1.90-LS2.4-BR
  rect 1x0.8 smd: 1(1.15,-0.95) 2(1.15,0.95) 3(-1.15,0)
SOT-583-8_L2.1-W1.2-P0.50-LS1.6-BL
  rect 0.28x0.68 smd: 1(-0.75,-0.64) 2(-0.25,-0.64) 3(0.25,-0.64) 4(0.75,-0.64) 5(0.75,0.64) 6(0.25,0.64) 7(-0.25,0.64) 8(-0.75,0.64)
Test-Point-1mm
  round 1 smd: 1(0,0)
TSOP-54_L22.2-W10.2-P0.80-LS11.8-BL
  oval 0.5x1.8 smd: 1(-10.4,-5.642) 2(-9.6,-5.642) 3(-8.8,-5.642) 4(-8,-5.642) 5(-7.2,-5.642) 6(-6.4,-5.642) 7(-5.6,-5.642) 8(-4.8,-5.642) 9(-4,-5.642) 10(-3.2,-5.642) 11(-2.4,-5.642) 12(-1.6,-5.642) 13(-0.8,-5.642) 14(0,-5.642) 15(0.8,-5.642) 16(1.6,-5.642) 17(2.4,-5.642) 18(3.2,-5.642) 19(4,-5.642) 20(4.8,-5.642) 21(5.6,-5.642) 22(6.4,-5.642) 23(7.2,-5.642) 24(8,-5.642) 25(8.8,-5.642) 26(9.6,-5.642) 27(10.4,-5.642) 28(10.4,5.642) 29(9.6,5.642) 30(8.8,5.642) 31(8,5.642) 32(7.2,5.642) 33(6.4,5.642) 34(5.6,5.642) 35(4.8,5.642) 36(4,5.642) 37(3.2,5.642) 38(2.4,5.642) 39(1.6,5.642) 40(0.8,5.642) 41(0,5.642) 42(-0.8,5.642) 43(-1.6,5.642) 44(-2.4,5.642) 45(-3.2,5.642) 46(-4,5.642) 47(-4.8,5.642) 48(-5.6,5.642) 49(-6.4,5.642) 50(-7.2,5.642) 51(-8,5.642) 52(-8.8,5.642) 53(-9.6,5.642) 54(-10.4,5.642)
USB-C-SMD_TYPE-C-6PIN-2MD-073
  rect 0.55x1.1 smd: 1(-3.2,2.375) 2(-2.4,2.375) 11(2.4,2.375) 12(3.2,2.375)
  rect 0.3x1.1 smd: 3(-1.75,2.375) 4(-1.25,2.375) 5(-0.75,2.375) 6(-0.25,2.375) 7(0.25,2.375) 8(0.75,2.375) 9(1.25,2.375) 10(1.75,2.375)
  oval 1.1x2 hole 0.6x1.5: 13(-4.325,1.825) 14(4.325,1.825)
  oval 1.2x1.8 hole 0.6x1.2: 13(-4.325,-2.375) 14(4.325,-2.375)
USON-10_L2.5-W1.0-P0.50-BL
  rect 0.25x0.609 smd: 1(-1,-0.414) 2(-0.5,-0.414) 4(0.5,-0.414) 5(1,-0.414) 6(1,0.414) 7(0.5,0.414) 9(-0.5,0.414) 10(-1,0.414)
  rect 0.38x0.609 smd: 3(0,-0.414) 8(0,0.414)
VSON-8_L2.0-W3.0-P0.50-BL-EP
  rect 0.28x0.665 smd: 1(-0.75,-1.407) 2(-0.25,-1.407) 3(0.25,-1.407) 4(0.75,-1.407) 5(0.75,1.407) 6(0.25,1.407) 7(-0.25,1.407) 8(-0.75,1.407)
  rect 1.6x1.4 smd: 9(0,0)
WIRELM-SMD_E32-433T20S
  oval 2x0.8 smd: 1(-8,11.315) 2(-8,10.045) 3(-8,8.775) 4(-8,7.505) 5(-8,6.235) 6(-8,4.965) 7(-8,3.695) 8(-8,2.425) 11(-8,-8.775) 12(-8,-10.045) 13(-8,-11.315) 14(8,-11.315) 15(8,-10.045) 16(8,-8.775) 19(8,2.425) 20(8,3.695) 21(8,4.965) 22(8,6.235) 23(8,7.505) 24(8,8.775) 25(8,10.045) 26(8,11.315)
WIRELM-SMD_HLK-7688A
  rect 1x1.8 smd: 1(16.05,9.35) 2(14.65,9.35) 3(13.25,9.35) 4(11.85,9.35) 5(10.45,9.35) 6(9.05,9.35) 7(7.65,9.35) 8(6.25,9.35) 9(4.85,9.35) 10(3.45,9.35) 11(2.05,9.35) 12(0.65,9.35) 13(-0.75,9.35) 14(-2.15,9.35) 15(-3.55,9.35) 16(-4.95,9.35) 17(-6.35,9.35) 18(-7.75,9.35) 19(-9.15,9.35) 20(-10.55,9.35) 21(-11.95,9.35) 22(-13.35,9.35) 23(-14.75,9.35) 34(-14.75,-9.35) 35(-13.35,-9.35) 36(-11.95,-9.35) 37(-10.55,-9.35) 38(-9.15,-9.35) 39(-7.75,-9.35) 40(-6.35,-9.35) 41(-4.95,-9.35) 42(-3.55,-9.35) 43(-2.15,-9.35) 44(-0.75,-9.35) 45(0.65,-9.35) 46(2.05,-9.35) 47(3.45,-9.35) 48(4.85,-9.35) 49(6.25,-9.35) 50(7.65,-9.35) 51(9.05,-9.35) 52(10.45,-9.35) 53(11.85,-9.35) 54(13.25,-9.35) 55(14.65,-9.35) 56(16.05,-9.35)
  rect 1.8x1 smd: 24(-16.05,6.35) 25(-16.05,4.95) 26(-16.05,3.55) 27(-16.05,2.15) 28(-16.05,0.75) 29(-16.05,-0.65) 30(-16.05,-2.05) 31(-16.05,-3.45) 32(-16.05,-4.85) 33(-16.05,-6.25)
  rect 5x5 smd: 57(-4.25,-0.25)
  rect 3.1x1.6 smd: 58(11.3,-2.55) 59(11.3,4.05)
WSON-8_L8.0-W6.10-P1.27-BL-EP
  oval 0.56x1.4 smd: 1(-1.905,-4.027) 2(-0.635,-4.027) 3(0.635,-4.027) 4(1.905,-4.027) 5(1.905,4.027) 6(0.635,4.027) 7(-0.635,4.027) 8(-1.905,4.027)
  rect 4.3x3.4 smd: 9(0,0)
反激电源模块_5v升压400v
  oval 5x1.8 hole 1: 1(0.573,11.684) 2(0.553,9.144) 3(24.915,11.684) 4(24.915,6.604)
盖革管4313
  oval 0.9x1.85 hole 0.65x1.6: 1(-54.722,1.994) 2(-47.023,1.994) 3(50.374,2.136) 4(58.075,2.136)

## Nets
As in the schematic.

Pads without a net: CN1 3 7 8; D7 2(5) 2(6) 2(8) 2(9) 5 6 8 9; LED9 1; U1 2 3 5; U6 3 7; U7 2 8 9 10 25 85 94 95 99 101 107 117 128 129 134 138 140 156 157 174 175 176; U8 40; U10 5 6 7 9 10 11 15 16 17 18 19 20 22 24 25 26 27 28 29 30 31 32 33 42 43 44 45 50 51 52 53 54 55; U11 7 12 13 18 24 46 47; U12 2 5 6 7 8 13 16 17 18 22 23; U13 5; U14 1 3 4 5 6 7 12; U15 5; U26 1 6; USB1 3 9

## Via types
v1: diameter 0.5, hole 0.305, Top Layer to Bottom Layer, 760 vias
v2: diameter 0.61, hole 0.305, Top Layer to Bottom Layer, 148 vias

## Routing (per net, layer and track width the routed paths; a pad name or vN(x,y) marks a point on that pad's centre or on a via; arc(x,y) is an arc through that point)
24V: length 90.9
  Inner2 w1: v1(55.46,12.74) v1(55.46,13.55) v1(55.46,14.24) 55.67,14.45 80.9,14.45 87.46,7.89 125.46,7.89 128.26,10.69 136.66,10.69 138.41,12.44 DC1.1
GND: length 374.3
  Top Layer w0.148: 114.14,26.38 114.14,26.38 v1(114.14,26.24) ; 101.8,28.13 101.81,28.13 ; 101.81,28.13 101.81,28.16 v1(101.81,28.16) ; 101.81,28.13 101.8,28.12 101.8,27.73 ; 114.14,26.82 114.14,26.38 ; v2(101.84,25.96) 101.84,25.97 101.84,27.45 ; 124.18,26.91 v1(124.18,26.08) ; 101.8,27.57 101.8,27.45
  Top Layer w0.156: C63.1 v1(109.45,54.79)
  Top Layer w0.157: v1(113.64,68.12) C82.1 C66.2 ; C66.2 C85.1 v1(110.34,68.12) ; C66.2 v1(111.99,68.12) ; U7.22 60.42,62.79 62.24,64.61 SW2.3 ; 75.63,54.22 75.37,54.22 v1(74.91,54.69) ; v2(114.12,25.57) 114.14,25.59 114.14,26.38 114.12,26.4 v1(114.12,28.41) ; v1(68.05,29.77) 68.05,30.42 C96.2 ; U7.158 73.92,51.07 74.6,50.39 C36.1 ; U7.14 64.42,62.98 v1(64.11,63.29) ; v1(61.25,32.05) C32.2 61.42,32.99 U7.113 ; C78.2 v1(114.91,63.55) ; v1(79.46,38.88) 79.25,38.67 U8.54 ; C86.1 v1(148.16,25.32) ; C100.1 72.26,30.44 v1(72.26,29.77)
  Top Layer w0.2: C45.1 74.34,46.54 73.97,46.18 73.93,46.18 73.82,46.07 U7.148 68.48,46.07 ; U16.5 47.35,27.75 v1(47.35,29.64) ; U16.6 54.84,27.8 v1(54.84,29.51)
  Top Layer w0.254: 49.92,38.03 49.92,38.07 50.03,38.18 50.03,38.22 50.21,38.39 50.21,39.19 ; 49.92,38.03 U7.90 ; 49.92,38.03 v1(49.56,38.39) ; v1(117.87,55.3) 117.05,55.3 117.03,55.28 ; 101.19,68.62 102.59,68.62 ; 101.19,68.62 v1(101.19,69.52) ; 101.19,68.62 C77.2 ; 101.19,68.62 R50.2 ; 102.59,68.62 C74.1 ; 102.59,68.62 103.99,68.62 ; 102.59,68.62 v1(102.59,69.64) ; C48.1 v2(72.11,33.07) ; C48.1 v2(71.41,32.31) ; C48.1 71.48,33.13 v2(71.48,33.96) ; D3.2 142.69,32.22 v2(142.6,32.31) ; U11.9 108.35,62.23 v1(108.69,61.9) ; U11.16 v1(104.18,64.06) ; Y2.4 93.3,59.26 93.37,59.19 C72.1 92.38,58.39 v1(92.18,58.6) ; v1(111.06,58.74) 111.21,58.74 C83.1 ; v2(52.93,60.5) 52.93,61.86 U7.37 ; C99.1 68.52,19.74 v1(67.96,19.74) ; C99.1 68.7,18.94 v1(68.06,18.94) ; C99.1 69.01,20.18 69.37,20.54 U15.2 ; R43.1 v1(96.37,51.48) ; CN1.2 v1(48.12,22.4) ; U7.102 55.92,34.53 55.41,34.02 C53.2 55.6,32.75 55.6,32.43 55.78,32.25 v1(55.86,32.25) ; v1(16.87,63.93) 17.75,63.93 R72.2 ; U7.126 67.92,34.59 68.3,34.21 68.3,33.13 C23.2 ; 91.32,47.67 92,47.67 v2(92.01,47.69) ; R54.2 144.37,16.22 v2(144.37,17.07) ; Y1.2 59.77,64.98 C54.1 59.92,63.86 59.98,63.8 ; C33.2 50.41,32.87 U16.2 ; U10.21 v1(97.75,48.05) ; v1(108.43,59.1) 108.18,59.1 108.05,59.23 U11.3 106.04,59.23 105.71,58.89 104.76,58.89 ; C23.2 v2(68.37,32.31) ; C23.2 v2(69.06,33.07) ; v1(105.64,69.39) C71.2 104.94,68.57 104.88,68.62 103.99,68.62 ; v1(148.19,20.39) 148.19,21.29 C87.1 ; v1(144.35,19.36) 144.28,19.44 144.28,20.26 ; v1(68.21,21.04) 68.27,21.11 C98.1 ; U11.14 v1(105.18,64.06) ; U3.1 155.37,40.63 v1(155.37,42.39) ; 59.98,63.8 v2(59.29,63.8) 57.89,63.8 v2(57.63,63.55) ; 59.98,63.8 60.23,63.8 60.76,64.33 60.76,67.43 v2(60.29,67.91) v2(58.28,67.91) v2(55.9,67.91) v2(53.75,67.91) ; v1(143.47,26.55) 142.77,26.55 142.71,26.48 ; 142.81,23.6 141.67,23.6 141.66,23.59 ; 103.99,68.62 v1(103.99,69.52) ; 103.99,68.62 C84.1 ; v2(53.75,67.91) 54.08,67.58 C57.1 55.75,66.54 Y1.4 ; v2(53.75,67.91) v2(53.26,67.42) 53.26,64.62 v2(54.35,63.54) v2(55.35,63.54) ; v1(95.48,64.19) C73.1 95,63.89 Y2.2 95.86,62.41 96.51,61.76 v1(97.26,61.76) ; C27.2 v1(59.16,25.96) ; v1(101.96,51.74) 102.04,51.82 R38.1 ; R71.1 v1(15.6,65.33) ; C61.1 121.36,51.74 121.55,51.54 ; v2(149.46,17.07) 149.46,16.45 149.2,16.2 ; C105.1 v1(12.93,63.73) ; U11.29 97.26,61.73 ; U11.48 v1(105.68,55.67) ; R34.2 v1(115.55,56.18) ; v2(74.43,38.78) 75.26,38.78 C43.1 74.6,39.57 74.48,39.57 74.47,39.57 U7.135 ; v1(102.72,64.06) 102.72,65.19 U11.19 ; R42.1 97.89,52.31 v1(97.89,51.48) ; C65.1 v1(115.93,53.26) ; C90.1 v1(151.24,20.26) ; R41.1 v1(99.25,51.61) ; v2(61.57,67.22) 61.57,66.53 ; U26.5 v1(2.39,5) ; C88.1 149.85,21.31 v1(149.85,20.28) ; R39.1 v1(100.64,51.61) ; U10.23 v1(94.95,48.18)
  Top Layer w0.3: C40.2 46.08,66.53 v1(46.08,67.23) ; U6.4 40.75,35.98 U6.9 ; 45.91,38.96 45.64,39.22 45.64,39.24 45.28,39.61 44.92,39.56 38.44,39.56 37.98,39.1 37.98,37.12 ; v1(7.72,2.59) 8.55,2.59 C341.2 9.44,2.65 v1(9.5,2.59) ; U8.28 77.62,59.63 C52.2 ; C93.2 37.11,46.59 38.06,47.55 38.06,48.77 ; U14.19 v1(158.48,52.75) ; v1(43.54,36.24) 43.56,36.22 C24.1 v1(44.3,35.43) ; 45.97,38.9 45.97,37.18 ; 45.97,38.9 45.97,39.01 ; 45.97,38.9 45.97,38.89 ; C20.2 75.39,63.17 75.96,63.17 76.31,62.82 v1(76.31,61.82) ; C62.2 97.77,28.75 ; v1(39.09,36.5) 39.09,37.27 C22.1 ; C29.2 75.3,44.08 74.23,44.08 74.02,43.86 74.02,42.34 74.65,41.7 75.92,41.7 76.57,41.06 76.57,40.84 76.81,40.6 76.81,40.31 77.02,40.1 77.32,40.1 77.5,40.27 U8.52 ; v1(82.53,46.53) 82.5,46.53 81.87,47.16 81.01,47.16 79.1,49.07 U8.41 ; C21.1 v1(44.89,36.62) ; C41.2 v1(47.6,67.23)
  Top Layer w0.326: v2(150.85,60.49) 150.85,58.09 150.86,58.08 Q7.2 ; R15.1 147.71,53.74 v1(147.81,53.84)
  Top Layer w0.35: U10.4 121.55,51.54 ; v2(120.5,52.63) 121.45,52.63 v2(121.45,53.64) ; v2(126.52,52.47) 126.44,52.55 125.9,52.55 125.75,52.4 U10.1
  Top Layer w0.4: 155.87,36.98 156.53,36.98 v2(156.57,37.03) ; 140.07,31.99 v2(140.69,31.99) ; v2(139.29,39.05) 140.06,39.05 C6.1 v2(140.18,38.02) ; 146.76,40.55 146.76,39.95 v2(145.93,39.12) ; C45.1 75.36,46.51 v1(76.23,46.51) ; v1(36.16,44.44) 36.2,44.4 C92.2 37.11,46.29 C93.2 36.76,45.94 v1(36.16,45.94) ; 85.84,62.08 85.84,62.07 85.84,61.45 85.9,61.38 ; 142.62,31.17 142.69,31.23 ; v2(132.79,27.73) L1.4 v2(132.79,24.33) ; v2(80.89,60.59) 80.91,60.6 80.91,61.31 ; 139.97,31.91 139.97,32.62 v2(139.98,32.63) ; v2(139.07,32.04) 139.89,32.04 139.93,32 ; v2(147.03,39.04) 147.03,40.4 146.91,40.53 ; v1(75.32,44.88) C29.2 75.77,44.09 76.75,45.07 U8.46 ; v1(13.91,46.19) C101.2 14.71,46.24 v1(14.71,47.09) ; v1(45.93,37.18) 45.37,36.62 v1(44.89,36.62) 44.51,36.24 v1(43.54,36.24) ; v1(38.02,37.18) 38.71,36.5 v1(39.09,36.5) 40.36,35.23 U6.9 ; D10.2 v2(146.91,16.05) ; 147.08,40.49 147.08,40.14 v2(148.16,39.06) ; C9.1 150.54,39.78 v2(149.77,39.01) ; 142.8,31.35 v2(143.88,31.35)
  Top Layer w0.5: C39.1 91.14,47.47 U8.12 ; v2(118.72,59.93) C79.1 116.31,59.93 ; C44.1 90.41,42.67 U8.6 ; C42.1 v2(46.97,61.83) ; v2(43.54,61.77) 44.49,61.77 C49.1
  Top Layer w0.55: v2(142.6,12.88) 143.28,12.19 USB1.1 ; v2(150.53,12.94) 150.44,12.94 149.84,12.33 ; v2(149.84,12.24) 149.84,12.33 ; 149.84,12.33 149.68,12.17 USB1.12
  Top Layer w0.6: v1(155.37,42.39) 156.09,42.39 C94.1 ; v1(14.66,33.74) 15.55,33.74 15.65,33.64 15.51,33.5 Q3.2
  Top Layer w0.8: U14.26 158.33,42.45 C94.1 v2(156.15,41.7) ; C95.1 v2(156.15,49.07)
  Top Layer w1: v1(51.81,15.54) 51.81,16.29 D17.2 52.71,16.34 v1(52.76,16.29) ; U24.4 135.48,78.15 138.02,75.61 U24.2 150.45,75.61 C104.1 ; v1(58.26,16.29) 59.11,16.29 D19.2 59.16,15.49 v1(59.11,15.44)
  Bottom Layer w0.254: 49.02,55.39 49.02,54.64 v1(48.97,54.59) ; v1(141.72,23.65) 141.73,23.66 141.77,23.66 ; 59.25,55.32 v1(59.89,55.32)
  Bottom Layer w0.3: v1(77.06,65.83) 77.06,66.34 76.53,66.88 v1(74.02,66.88) v1(71.57,66.88) v1(70.73,66.04) 60.01,55.32 v1(59.89,55.32) ; 77.75,67.18 77.09,67.84 v1(75.16,67.84) v1(71.8,67.84) 71,67.84 66.98,63.82 v1(66.97,63.82) 66.97,63.74 63.35,60.12 61.06,60.12 59.41,58.47 59.41,56.31 v1(59.36,56.31) v1(58.28,56.31) 58.27,56.3 v1(56.72,56.3) 55.15,56.3 v1(55.13,56.31) 55.13,56.28 53.15,56.28 v1(53.15,56.3) 53.13,56.28 51.79,56.28 51.78,56.28 v1(51.78,56.31) 51.71,56.24 49.87,56.24 49.02,55.39 ; 52.98,55.34 52.91,55.27 v1(50.71,55.27) ; v1(53.11,55.32) v1(55.92,55.32) v1(58.37,55.32) 59.25,55.32
  vias: v1(1.91,37.13) v1(1.91,35.42) v1(1.91,33.71) v1(1.91,32) v1(1.91,30.29) v1(1.91,28.59) v1(1.91,26.88) v1(1.91,25.17) v1(2.57,63.56) v1(2.57,61.85) v1(2.57,60.14) v1(2.57,58.44) v1(2.57,56.73) v1(2.57,55.02) v1(2.57,53.31) v1(2.57,51.35) v1(2.57,49.64) v1(2.57,47.93) v1(2.57,46.23) v1(2.57,44.52) v1(2.57,42.81) v1(2.57,41.1) v1(2.57,39.39) v1(2.87,32.96) v1(2.87,31.25) v1(2.87,29.54) v1(2.87,27.84) v1(2.87,26.13) v1(2.87,24.42) v1(2.87,22.71) v1(2.87,21) v1(3.58,54.19) v1(3.68,52.26) v1(3.68,50.56) v1(3.68,48.85) v1(3.68,47.14) v1(3.68,45.43) v1(3.68,43.72) v1(3.68,42.02) v1(3.68,40.31) v1(10.34,60.58) v1(10.29,59.31) v1(10.44,61.8) v1(10.39,58.14) v1(10.39,57.17) v1(10.54,62.76) v1(10.69,63.68) v1(12.16,46.14) v1(13.06,46.89) v1(15.42,18.87) v1(16.18,50.98) v1(16.43,19.78) v1(17.13,18.87) v1(17.73,63.12) v1(18.14,19.78) v1(18.84,18.87) v1(19.23,63.12) v1(19.85,19.78) v1(20.27,63.12) v1(20.35,35.43) v1(20.54,18.87) v1(21.01,34.21) v1(21.56,19.78) v1(22.07,35.38) v1(22.25,18.87) v1(22.63,63.01) v1(22.86,34.16) v1(23.27,19.78) v1(23.78,35.38) v1(23.96,18.87) v1(24.44,63.01) v1(24.61,34.11) v1(24.82,54.07) v1(24.98,19.78) v1(25.53,68.35) v1(25.49,35.38) v1(25.67,18.87) v1(25.78,63.01) v1(26.68,19.78) v1(27.38,18.87) v1(27.86,68.3) v1(27.93,38.58) v1(28.39,19.78) v1(29.08,18.87) v1(29.58,38.58) v1(30.25,68.35) v1(30.91,18.77) v1(32.62,18.77) v1(34.33,18.77) v1(36.04,18.77) v1(37.75,18.77) v1(37.94,39.13) v1(37.92,38.1) v1(38.02,63.62) v1(38.55,39.58) v1(39.45,18.77) v1(39.84,39.59) v1(40.11,63.68) v1(41.2,39.54) v1(41.16,18.77) v1(42.41,46.51) v1(42.62,18.82) v1(42.92,39.53) v1(44.02,18.56) v1(44.42,39.59) v1(45.73,18.56) v1(45.96,38.96) v1(46.02,38.1) v1(46.84,37.66) v1(47.44,18.56) v1(49.14,18.56) v1(50.85,18.56) v1(51.77,38.18) v1(52.56,18.56) v1(54.27,18.56) v1(55.98,18.56) v1(57.68,18.56) v1(66.78,29.39) v1(66.9,42.85) v1(67.03,44.88) v1(67.03,27.99) v1(78.21,66.77) v1(80.19,21.05) v1(81.89,39.57) v1(81.9,21.05) v1(83.6,21.05) v1(85.31,21.05) v1(87.02,21.05) v1(88.73,21.05) v1(90.44,21.05) v1(92.15,21.05) v1(103.57,28.2) v1(104.12,41.2) v1(104.12,38.66) v1(105.45,39.93) v1(106.78,41.2) v1(106.78,38.4) v1(111.74,25.83) v1(114.91,64.31) v1(115.8,62.66) v1(121,46.26) v1(121,37.63) v1(122.71,63.17) v1(122.86,65.66) v1(146.94,62.3) v1(146.99,65.05) v1(151.49,27.86) v1(152.32,27.3) v1(153.26,27.86) v1(160.71,7.29) v1(160.76,11.15) v1(160.76,9.32) v1(160.76,5.51) v1(161.57,6.32) v1(161.67,10.28) v1(161.72,8.3) v1(162.13,4.95) v1(163.3,4.8) v1(163.5,3.58) v1(164.97,3.43) v1(165.33,2.16) v1(166.45,1.29) v1(167.36,2.21) v1(168.16,1.29) v1(169.2,2.26) v1(169.86,1.29) v1(170.91,2.26) v1(171.57,1.29) v1(172.61,2.26) v1(173.28,1.29) v1(174.32,2.26) v1(174.52,31.93) v1(174.57,37.26) v1(174.63,34.72) v1(174.57,33.4) v1(174.68,38.83) v1(174.68,30.12) v1(174.68,28.41) v1(174.68,26.7) v1(174.68,24.99) v1(174.68,23.28) v1(174.68,21.57) v1(174.68,19.87) v1(174.68,18.16) v1(174.78,16.25) v1(174.78,14.54) v1(174.78,12.83) v1(174.78,11.13) v1(174.78,9.42) v1(174.78,7.71) v1(174.78,6) v1(174.78,4.29) v1(175.18,3.17) v1(175.39,39.55) v1(175.39,37.97) v1(175.39,36.09) v1(175.44,34.26) v1(175.49,32.81) v1(175.49,31.1) v1(175.49,29.39) v1(175.49,27.68) v1(175.49,25.98) v1(175.49,24.27) v1(175.49,22.56) v1(175.49,20.85) v1(175.54,5.1) v1(175.59,18.79) v1(175.59,17.08) v1(175.59,15.37) v1(175.59,13.66) v1(175.59,11.95) v1(175.59,10.25) v1(175.59,8.54) v1(175.59,6.83) v2(64.11,34.21) v2(65.58,32.49) v2(85.84,62.08) v2(94.48,32.42) v2(96.92,32.44) v2(102.95,32.52) v2(105.21,32.54) v2(109.69,34.44) v2(111.87,35.1) v2(112.63,55.61) v2(113.69,33.88) v2(116.85,29.38) v2(117.04,55.93) v2(119.25,29.39) v2(127.69,49.96) v2(129.99,50.24) v2(130.01,47.89) v2(132.46,47.49) v2(133.82,54) v2(138.16,47.24) v2(139.91,47.24) v2(140.95,53.59) v2(143.09,53.51) v2(143.06,28.81) v2(143.1,12.38) v2(144.37,44.91) v2(144.37,43.65) v2(145.7,46.04) v2(145.69,44.91) v2(145.67,43.65) v2(148.83,50.1) v2(155.55,34.99) v2(155.61,33.55) v2(157.61,36.69) v2(158.58,36.69) v2(159.53,35.05) v2(159.54,33.57)
PGND: length 36.5
  Top Layer w2: 108.15,19.3 108.15,19.19 109.73,17.62 124.39,17.62 124.74,17.97 ; 108.15,19.3 106.61,17.76 94.29,17.76 ; 108.15,19.3 108.15,20.98 ; 122.19,20.8 122.19,18.21 122.01,18.04
  vias: v1(18.39,5.76) v1(19.28,6.02) v1(20.2,5.76) v1(21.09,6.02) v1(22.01,5.76) v1(22.9,6.02) v1(23.83,5.76) v1(24.71,6.02) v1(25.64,5.76) v1(26.53,6.02) v1(27.45,5.76) v1(28.34,6.02) v1(29.26,5.76) v1(30.15,6.02) v1(31.07,5.76) v1(31.96,6.02) v1(32.89,5.76) v1(33.77,6.02) v1(34.7,5.76) v1(35.59,6.02) v1(36.51,5.76) v1(37.4,6.02) v1(38.32,5.76) v1(39.21,6.02) v1(40.13,5.76) v1(41.02,6.02) v1(41.95,5.76) v1(42.83,6.02) v1(43.76,5.76) v1(44.65,6.02) v1(45.57,5.76) v1(46.46,6.02) v1(47.38,5.76) v1(48.27,6.02) v1(49.19,5.76) v1(50.08,6.02) v1(51,5.76) v1(51.89,6.02) v1(52.68,6.61) v1(52.82,5.76) v1(53.71,6.02) v1(56.44,5.76) v1(58.25,5.76) v1(58.27,6.67) v1(59.14,6.02) v1(60.13,6.72) v1(60.06,5.76) v1(60.95,6.02) v1(61.88,5.76) v1(62.76,6.02) v1(63.69,5.76) v1(64.58,6.02) v1(65.5,5.76) v1(66.39,6.02) v1(67.31,5.76) v1(68.2,6.02) v1(69.12,5.76) v1(70.01,6.02) v1(70.93,5.76) v1(71.82,6.02) v1(72.75,5.76) v1(73.64,6.02) v1(75.09,5.89) v1(75.92,6.14) v1(76.91,5.89) v1(77.73,6.14) v1(78.72,5.89) v1(79.54,6.14) v1(80.53,5.89) v1(81.36,6.14) v1(82.34,5.89) v1(83.17,6.14) v1(84.15,5.89) v1(84.98,6.14) v1(85.97,5.89) v1(86.79,6.14) v1(87.78,5.89) v1(88.6,6.14) v1(89.59,5.89) v1(90.42,6.14) v1(91.4,5.89) v1(92.23,6.14) v1(93.21,5.89) v1(94.04,6.14) v1(95.03,5.89) v1(95.85,6.14) v1(96.84,5.89) v1(97.66,6.14) v1(98.65,5.89) v1(99.48,6.14) v1(100.46,5.89) v1(101.29,6.14) v1(102.27,5.89) v1(103.1,6.14) v1(104.09,5.89) v1(104.91,6.14) v1(105.9,5.89) v1(106.72,6.14) v1(107.71,5.89) v1(108.53,6.14) v1(109.52,5.89) v1(110.35,6.14) v1(111.33,5.89) v1(112.16,6.14) v1(113.14,5.89) v1(113.97,6.14) v1(114.96,5.89) v1(115.78,6.14) v1(116.77,5.89) v1(117.59,6.14) v1(118.58,5.89) v1(119.41,6.14) v1(120.39,5.89) v1(121.22,6.14) v1(122.2,5.89) v1(123.03,6.14) v1(124.02,5.89) v1(124.84,6.14) v1(125.83,5.89) v1(126.47,19.1) v1(126.65,6.14) v1(127.1,21.77) v1(127.48,19.1) v1(127.64,5.89) v1(130.59,5.76) v1(131.42,6.02) v1(132.4,5.64) v1(133.22,6.02) v1(134.21,5.76) v1(135.04,6.02) v1(136.02,5.76) v1(137.07,5.89) v1(140.06,5.76) v1(141.04,5.76) v1(143.17,5.89) v1(144.22,6.02) v1(145.33,5.89) v1(146.38,6.02) v1(147.2,5.89) v1(148.18,5.89) v1(149.36,5.89) v1(150.53,8.18) v1(151.58,8.3) v1(152.25,5.89) v1(153.3,5.76) v1(154.28,5.76) v1(159.11,5.72)
VBUS: length 39.1
  Top Layer w0.285: 155.62,38.67 156.08,38.67 156.09,38.66 ; 155.62,38.67 155.6,38.67 ; 155.62,38.67 155.65,38.64 156.09,38.66 ; 157.12,38.5 156.92,38.69 156.09,38.66 ; 156.09,38.66 157.13,37.62 157.88,37.62
  Top Layer w0.4: v2(146.91,15.16) D10.5 v2(146.91,13.64)
  Top Layer w0.55: v2(149.45,13.26) v2(148.88,12.68) USB1.11 ; USB1.2 144.08,12.9 v2(143.69,13.28)
  Top Layer w2: 151.13,14.74 153.26,14.74 162.05,23.52 162.05,35.97 160.25,37.77
  vias: v2(144.08,12.66) v2(150.79,15.04) v2(151.11,14.09) v2(151.63,15.09)
VCC_3V3: length 248.6
  Top Layer w0.157: U7.6 68.42,60.89 68.65,60.66 71.13,60.66 72.87,62.4 SW1.4 ; R19.1 v1(93.57,51.61) ; 61.57,65.19 61.57,65.47 v1(61.36,65.68) ; U7.114 61.92,34.11 62.59,33.45 v1(62.59,32.05) ; v1(74.47,61.84) 74.5,61.82 74.57,61.82 ; 75.28,61.82 75.08,61.82 ; v1(62.48,63.25) 62.69,63.04 63.6,63.04 63.92,62.72 U7.15
  Top Layer w0.2: C47.2 61.57,64.56 59.92,62.92 U7.23
  Top Layer w0.254: 49.13,67.95 49.13,66.4 49.21,66.32 ; 75.29,39.86 75.29,39.85 ; 75.29,39.86 v1(75.3,39.85) 75.29,39.85 ; 75.29,39.86 75.29,39.96 75.17,40.07 U7.136 ; 75.29,39.85 75.29,39.84 ; v1(47.92,32.56) 47.98,32.56 48.36,32.94 C33.1 49.15,32.72 U16.1 ; 91.31,49.07 92.05,49.09 v2(92.06,49.1) ; 91.31,49.07 v1(91.31,49.96) ; 91.31,49.07 C39.2 ; v1(57.51,32.94) C53.1 56.81,34.15 56.42,34.53 U7.103 ; 44.52,46.56 47.08,46.56 47.08,46.59 ; 151.33,22.8 151.33,24.19 151.57,24.42 U12.20 ; C88.2 149.84,22.73 149.84,23.29 150.34,23.8 v1(150.6,23.8) ; R76.2 59.1,28.36 ; 59.1,28.36 C27.1 ; 59.1,28.36 59.03,28.43 59.03,29.08 v1(59.08,29.13) ; D5.1 v1(43.5,25.45) ; 145.73,20.28 145.73,20.96 146.14,21.37 U13.10 ; 145.73,20.28 C89.2 ; 145.73,20.28 144.64,21.37 U13.7 ; v1(158.09,21.77) 157.69,21.36 R59.1 157.05,21.32 R58.1 ; 44.49,41.96 45.7,41.96 46.08,41.57 U7.82 ; 151.33,22.79 151.29,22.84 ; 75.34,61.83 75.09,61.83 75.08,61.82 74.57,61.82 74.14,61.39 74.14,59.1 75.09,58.16 75.28,58.16 ; 77.54,42.67 76.56,42.67 ; 77.54,42.67 U8.49 ; 77.54,42.67 75.31,42.62 75.3,42.61 ; v1(70.01,32.18) C48.2 70.01,33.9 68.42,35.49 U7.127 ; C31.1 90.58,38.72 90.54,38.67 U8.1 87.34,38.67 87.08,38.93 87.08,39.91 87.4,40.23 89.02,40.23 U8.3 ; 68.47,66.18 68.47,67.68 67.94,68.21 ; v1(67.97,68.25) 67.91,68.31 67.2,68.31 ; 75.28,58.16 75.37,58.26 ; 75.28,58.16 75.32,58.11 ; 73.05,58.09 75.2,58.09 ; 53.44,62.16 53.44,63.55 52.38,64.61 52.38,65.1 C37.1 ; 68.49,66.18 69.33,65.34 69.33,64.61 ; 73.03,51.6 75.3,51.6 75.35,51.66 ; 142.7,24.94 142.7,24.59 v1(142.69,24.59) ; 69.33,64.61 SW1.4 ; 69.33,64.61 69.33,64.51 ; 73.52,46.57 73.89,46.57 74.3,46.97 74.3,47.45 74.76,47.91 ; 75.45,47.91 76,47.91 76.37,47.53 77.54,47.53 ; C44.2 v1(91.29,45.9) ; C40.1 L5.1
  Top Layer w0.3: R77.1 v1(8.61,7.92) ; R60.1 R61.1 156.32,57.85 156.34,57.82 R62.1 ; C40.1 44.68,66.53 v1(44.68,67.23) ; 22.94,66.65 v1(22.94,67.41) ; R79.2 v1(2.9,9.44) ; 44.4,41.88 44.34,41.94 v1(43.9,41.94) ; U7.91 50.42,35.35 ; v1(51.66,65.2) 51.73,65.13 C37.1 ; v1(74.12,48.48) 74.66,47.94 C45.2 ; C50.2 48.84,67.87 v1(48.11,67.87) ; U7.49 47.61,58.09 v1(46.2,58.09) ; v1(44.52,45.69) 44.49,45.71 C51.2 ; 75.28,42.96 75.19,43.04 ; C30.1 44.65,51.57 U7.62 ; 75.37,47.94 76.18,48.75 76.18,51.25 75.63,51.79 C36.2 ; 75.12,42.97 74.84,43.24 v1(74.59,43.24) ; v1(146.22,20.13) 146.2,20.1 145.86,20.1 ; C55.1 75.68,68.5 v1(75.79,68.39) ; R78.2 v1(5.82,10.08) ; R17.2 v1(46.01,30.4) ; C93.1 v1(39.51,46.29) ; R18.2 v1(46.01,36.37) ; C31.1 v1(91.29,37.64)
  Top Layer w0.4: C30.1 44.64,47.53 44.49,47.38 C51.2 ; 87.2,62.17 87.25,62.13 87.25,61.38 87.2,61.34 ; 88.73,59.54 87.62,59.54 87.25,59.91 87.25,61.27 ; v1(39.31,44.39) 39.3,44.4 C92.1 38.51,44.41 C93.1 ; 79.44,63.58 79.44,61.56 79.61,61.39 79.61,60.65 v2(79.6,60.64)
  Top Layer w0.5: C79.2 117.96,63 C78.1 ; C44.2 91.16,45.07 U8.9 ; L5.1 44.61,63.29 C49.2 v2(43.54,63.23) ; U8.14 91.28,49.07
  Top Layer w0.55: 152.79,22.8 150.24,22.8
  Top Layer w0.6: R61.1 155.61,57.9 v1(155.61,58.69) ; R57.2 v1(152.71,23.42)
  Top Layer w1: 117.47,63.5 119.09,63.5 120.92,61.67 120.92,58.23 122.01,57.14 127.7,57.14 ; 117.25,66.1 117.25,63.96
  Bottom Layer w0.6: v1(128.88,51.61) 128.88,42.85 135.99,35.73 140.57,35.73 152.71,23.59 v1(152.71,23.42) 154.36,21.77 v1(158.09,21.77) ; v1(155.61,58.69) 154.9,57.98 v2(129.38,57.98)
  vias: v1(13.01,44.05) v1(13.86,44.05) v1(50.42,35.35) v1(68.79,67.58) v1(127.02,54.42) v1(127.99,55.29) v2(87.22,62.12) v2(125.58,57.18) v2(127.1,57.2) v2(129.33,56.39)
VCC_5V: length 281.7
  Top Layer w0.254: C87.2 148.21,22.73 149.56,24.07 C86.2 ; 71.31,18.97 71.38,18.97 ; C86.2 150.37,24.38 151.07,25.08 U12.19 ; C86.2 149.58,24.4 v1(149.58,25.19) ; 71.38,18.85 72.09,18.85
  Top Layer w0.285: 156.59,39.57 156.2,39.18 155.61,39.18 ; 153.33,40.19 153.33,39.81 153.96,39.19 154.19,39.15 154.63,39.15 ; 154.63,39.16 155.61,39.16
  Top Layer w0.326: v2(141.08,52.2) 142.05,52.2 C17.2 ; 150.91,66.92 R70.1 150.72,65.25 ; v1(133.81,55.89) 133.81,55.39 R14.2
  Top Layer w0.35: U15.3 70.64,21.2 C98.2 71.01,20.82 C99.2
  Top Layer w0.8: C94.2 156.17,43.87 U14.25
  Top Layer w1: Q5.2 150.91,65.45 C103.1 151.99,65.2 152.63,64.56 152.63,51.1 ; 156,45.61 155.96,45.57 153.64,45.57 ; C94.2 156.15,45.66
  Inner2 w0.6: v1(153.06,39.39) 153.03,39.42 151.61,39.42 149.58,37.39 v1(149.58,25.19)
  Inner2 w1.5: 153.14,39.8 153.01,39.92 v2(153.01,41.16) ; 153.01,40.56 112.62,40.56 108.43,36.37 94.34,36.37 90.4,32.43 90.4,28.88 88.88,27.35 79.65,27.35 72.12,19.82 v1(72.12,18.87)
  Bottom Layer w0.326: v1(133.81,55.89) 136.36,55.89 140.05,52.2 v2(141.08,52.2)
  Bottom Layer w0.4: v2(157.49,39.44) 158.5,39.44 163.42,44.37 165.2,44.37 ; 165.2,49.78 165.2,44.38 166.36,44.38 LED6.4 ; 165.2,49.78 165.2,55.55 ; 165.2,49.78 166.2,49.78 LED7.4 ; 165.2,27.95 165.2,22.53 165.84,21.89 166.24,21.89 LED2.4 ; 165.2,27.95 165.2,33.83 ; 165.2,27.95 165.55,27.61 LED3.4 ; 165.2,55.55 165.22,55.53 LED8.4 ; 165.2,55.55 165.2,61.14 165.49,61.42 165.89,61.42 166.19,61.12 LED9.4 ; 165.2,44.37 165.2,38.83 ; 165.2,44.37 165.58,44.37 ; 165.2,38.83 166.32,38.83 LED5.4 ; 165.2,38.83 165.2,33.83 ; 165.2,33.83 165.84,33.19 LED4.4
  Bottom Layer w1: 38.51,23.73 38.69,23.62 39.63,22.69 ; 38.51,23.73 16.17,23.73 14.71,25.19 v1(14.36,25.19) ; 38.51,23.73 38.77,23.73 ; v2(72.1,19.81) 68.61,23.3 40.14,23.3 v1(39.73,23.71)
  vias: v1(38.84,22.53) v1(38.98,23.71) v1(39.73,22.53) v2(153.06,40.19) v2(156.74,39.43)
